# Altium schematic sheet Voltage_Sense.SchDoc: Solar Sense Slave
size Tabloid; SheetNumber: 3; SheetTotal: 4; Website: www.uwmidsun.com
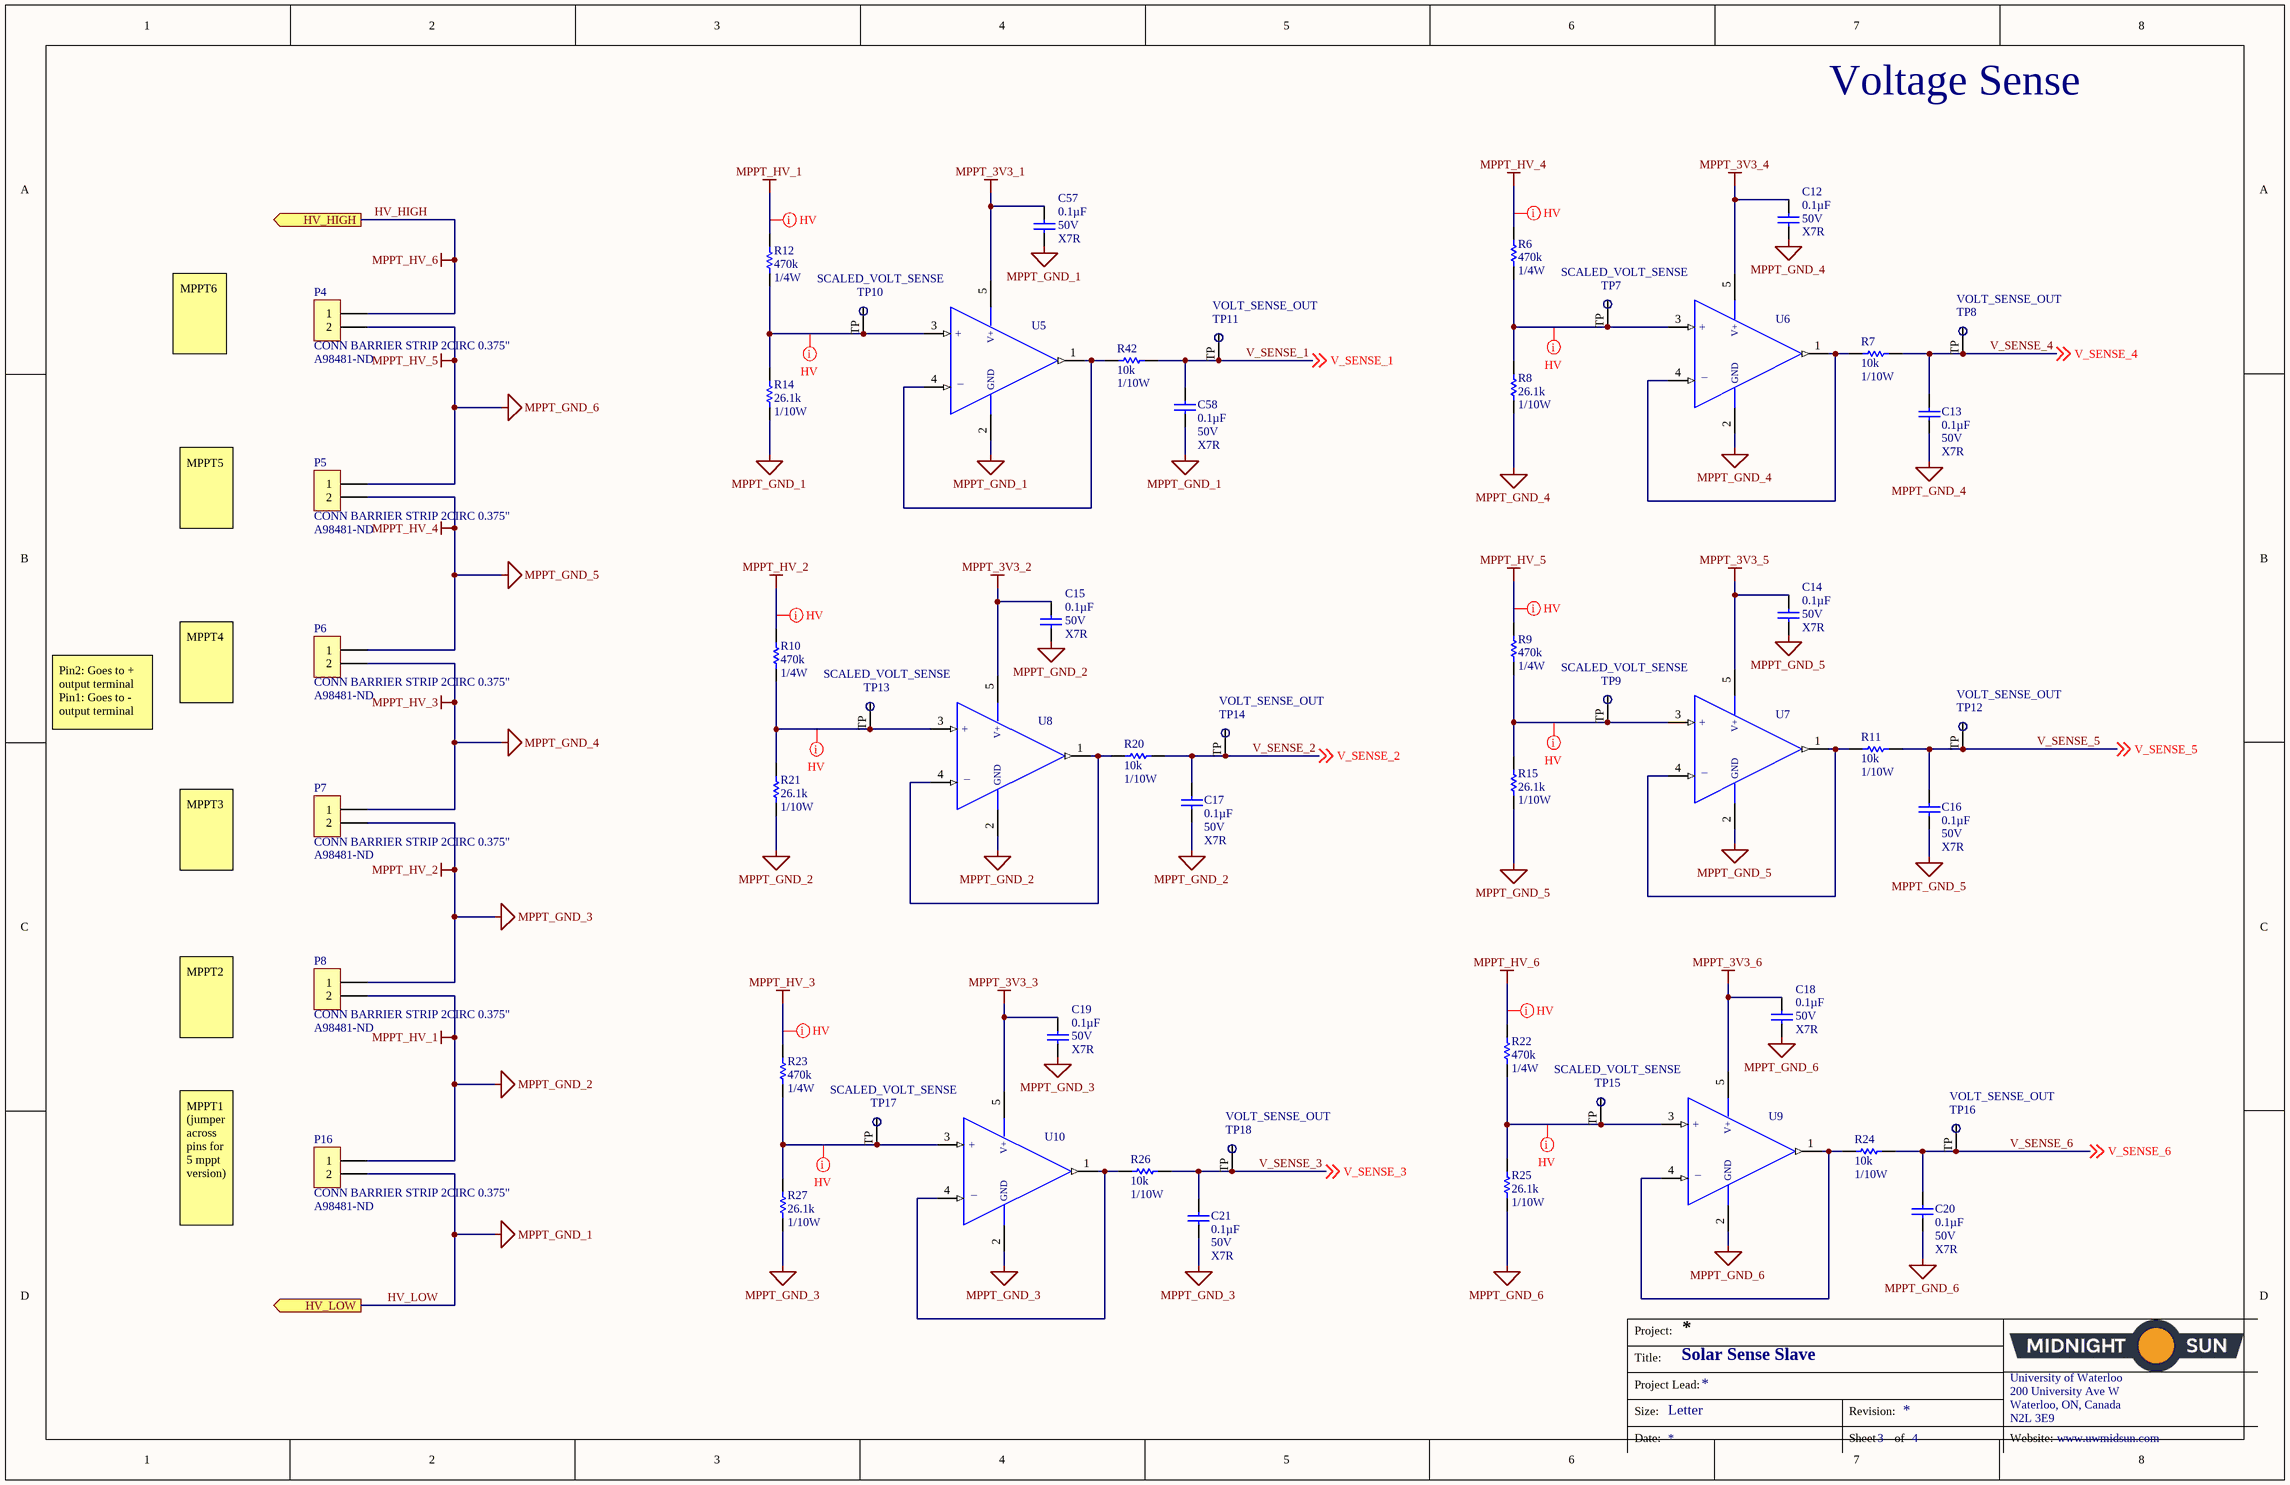
[diagram p0: Voltage_Sense.SchDoc]

## Parts
C12  Capacitance: 0.1µF  Voltage: 50V  Temperature Coefficient: X7R  [CAP, 0603]  (hidden comment: CAP CER 0.1UF 50V 10% X7R 0603)
C13  Capacitance: 0.1µF  Voltage: 50V  Temperature Coefficient: X7R  [CAP, 0603]  (hidden comment: CAP CER 0.1UF 50V 10% X7R 0603)
C14  Capacitance: 0.1µF  Voltage: 50V  Temperature Coefficient: X7R  [CAP, 0603]  (hidden comment: CAP CER 0.1UF 50V 10% X7R 0603)
C15  Capacitance: 0.1µF  Voltage: 50V  Temperature Coefficient: X7R  [CAP, 0603]  (hidden comment: CAP CER 0.1UF 50V 10% X7R 0603)
C16  Capacitance: 0.1µF  Voltage: 50V  Temperature Coefficient: X7R  [CAP, 0603]  (hidden comment: CAP CER 0.1UF 50V 10% X7R 0603)
C17  Capacitance: 0.1µF  Voltage: 50V  Temperature Coefficient: X7R  [CAP, 0603]  (hidden comment: CAP CER 0.1UF 50V 10% X7R 0603)
C18  Capacitance: 0.1µF  Voltage: 50V  Temperature Coefficient: X7R  [CAP, 0603]  (hidden comment: CAP CER 0.1UF 50V 10% X7R 0603)
C19  Capacitance: 0.1µF  Voltage: 50V  Temperature Coefficient: X7R  [CAP, 0603]  (hidden comment: CAP CER 0.1UF 50V 10% X7R 0603)
C20  Capacitance: 0.1µF  Voltage: 50V  Temperature Coefficient: X7R  [CAP, 0603]  (hidden comment: CAP CER 0.1UF 50V 10% X7R 0603)
C21  Capacitance: 0.1µF  Voltage: 50V  Temperature Coefficient: X7R  [CAP, 0603]  (hidden comment: CAP CER 0.1UF 50V 10% X7R 0603)
C57  Capacitance: 0.1µF  Voltage: 50V  Temperature Coefficient: X7R  [CAP, 0603]  (hidden comment: CAP CER 0.1UF 50V 10% X7R 0603)
C58  Capacitance: 0.1µF  Voltage: 50V  Temperature Coefficient: X7R  [CAP, 0603]  (hidden comment: CAP CER 0.1UF 50V 10% X7R 0603)
P4  CONN BARRIER STRIP 2CIRC 0.375"  Supplier Part Number 1: A98481-ND  [TE_3-1437652-9]
P5  CONN BARRIER STRIP 2CIRC 0.375"  Supplier Part Number 1: A98481-ND  [TE_3-1437652-9]
P6  CONN BARRIER STRIP 2CIRC 0.375"  Supplier Part Number 1: A98481-ND  [TE_3-1437652-9]
P7  CONN BARRIER STRIP 2CIRC 0.375"  Supplier Part Number 1: A98481-ND  [TE_3-1437652-9]
P8  CONN BARRIER STRIP 2CIRC 0.375"  Supplier Part Number 1: A98481-ND  [TE_3-1437652-9]
P16  CONN BARRIER STRIP 2CIRC 0.375"  Supplier Part Number 1: A98481-ND  [TE_3-1437652-9]
R6  Resistance: 470k  Power: 1/4W  [RES, 0603]  (hidden comment: RES 470K OHM 1% 1/4W 0603)
R7  Resistance: 10k  Power: 1/10W  [RES, 0603]  (hidden comment: RES 10K OHM 1% 1/10W 0603)
R8  Resistance: 26.1k  Power: 1/10W  [RES, 0603]  (hidden comment: RES 26.1K OHM 1% 1/10W 0603)
R9  Resistance: 470k  Power: 1/4W  [RES, 0603]  (hidden comment: RES 470K OHM 1% 1/4W 0603)
R10  Resistance: 470k  Power: 1/4W  [RES, 0603]  (hidden comment: RES 470K OHM 1% 1/4W 0603)
R11  Resistance: 10k  Power: 1/10W  [RES, 0603]  (hidden comment: RES 10K OHM 1% 1/10W 0603)
R12  Resistance: 470k  Power: 1/4W  [RES, 0603]  (hidden comment: RES 470K OHM 1% 1/4W 0603)
R14  Resistance: 26.1k  Power: 1/10W  [RES, 0603]  (hidden comment: RES 26.1K OHM 1% 1/10W 0603)
R15  Resistance: 26.1k  Power: 1/10W  [RES, 0603]  (hidden comment: RES 26.1K OHM 1% 1/10W 0603)
R20  Resistance: 10k  Power: 1/10W  [RES, 0603]  (hidden comment: RES 10K OHM 1% 1/10W 0603)
R21  Resistance: 26.1k  Power: 1/10W  [RES, 0603]  (hidden comment: RES 26.1K OHM 1% 1/10W 0603)
R22  Resistance: 470k  Power: 1/4W  [RES, 0603]  (hidden comment: RES 470K OHM 1% 1/4W 0603)
R23  Resistance: 470k  Power: 1/4W  [RES, 0603]  (hidden comment: RES 470K OHM 1% 1/4W 0603)
R24  Resistance: 10k  Power: 1/10W  [RES, 0603]  (hidden comment: RES 10K OHM 1% 1/10W 0603)
R25  Resistance: 26.1k  Power: 1/10W  [RES, 0603]  (hidden comment: RES 26.1K OHM 1% 1/10W 0603)
R26  Resistance: 10k  Power: 1/10W  [RES, 0603]  (hidden comment: RES 10K OHM 1% 1/10W 0603)
R27  Resistance: 26.1k  Power: 1/10W  [RES, 0603]  (hidden comment: RES 26.1K OHM 1% 1/10W 0603)
R42  Resistance: 10k  Power: 1/10W  [RES, 0603]  (hidden comment: RES 10K OHM 1% 1/10W 0603)
TP7  SCALED_VOLT_SENSE  [Test Point]  (no BOM)
TP8  VOLT_SENSE_OUT  [Test Point]
TP9  SCALED_VOLT_SENSE  [Test Point]  (no BOM)
TP10  SCALED_VOLT_SENSE  [Test Point]  (no BOM)
TP11  VOLT_SENSE_OUT  [Test Point]
TP12  VOLT_SENSE_OUT  [Test Point]
TP13  SCALED_VOLT_SENSE  [Test Point]  (no BOM)
TP14  VOLT_SENSE_OUT  [Test Point]
TP15  SCALED_VOLT_SENSE  [Test Point]  (no BOM)
TP16  VOLT_SENSE_OUT  [Test Point]
TP17  SCALED_VOLT_SENSE  [Test Point]  (no BOM)
TP18  VOLT_SENSE_OUT  [Test Point]
U5  IC OP AMP GEN PURPOSE RR 10MHZ SOT-23-5  [IC OP AMP GP RR 10MHZ SOT-23-5]  (value not drawn)
U6  IC OP AMP GEN PURPOSE RR 10MHZ SOT-23-5  [IC OP AMP GP RR 10MHZ SOT-23-5]  (value not drawn)
U7  IC OP AMP GEN PURPOSE RR 10MHZ SOT-23-5  [IC OP AMP GP RR 10MHZ SOT-23-5]  (value not drawn)
U8  IC OP AMP GEN PURPOSE RR 10MHZ SOT-23-5  [IC OP AMP GP RR 10MHZ SOT-23-5]  (value not drawn)
U9  IC OP AMP GEN PURPOSE RR 10MHZ SOT-23-5  [IC OP AMP GP RR 10MHZ SOT-23-5]  (value not drawn)
U10  IC OP AMP GEN PURPOSE RR 10MHZ SOT-23-5  [IC OP AMP GP RR 10MHZ SOT-23-5]  (value not drawn)

## Ports
HV_HIGH (out), HV_LOW (out)

## Nets
HV_HIGH: P4.1 R22.1 ; port HV_HIGH  [also labelled MPPT_HV_6]
HV_LOW: C57.2 C58.2 P16.2 R14.2 U5.2(VSS) ; port HV_LOW  [also labelled MPPT_GND_1]
MPPT_3V3_1: C57.1 U5.5(VDD)
MPPT_3V3_2: C15.1 U8.5(VDD)
MPPT_3V3_3: C19.1 U10.5(VDD)
MPPT_3V3_4: C12.1 U6.5(VDD)
MPPT_3V3_5: C14.1 U7.5(VDD)
MPPT_3V3_6: C18.1 U9.5(VDD)
MPPT_GND_2: C15.2 C17.2 P8.2 P16.1 R12.1 R21.2 U8.2(VSS)  [also labelled MPPT_HV_1]
MPPT_GND_3: C19.2 C21.2 P7.2 P8.1 R10.1 R27.2 U10.2(VSS)  [also labelled MPPT_HV_2]
MPPT_GND_4: C12.2 C13.2 P6.2 P7.1 R8.2 R23.1 U6.2(VSS)  [also labelled MPPT_HV_3]
MPPT_GND_5: C14.2 C16.2 P5.2 P6.1 R6.1 R15.2 U7.2(VSS)  [also labelled MPPT_HV_4]
MPPT_GND_6: C18.2 C20.2 P4.2 P5.1 R9.1 R25.2 U9.2(VSS)  [also labelled MPPT_HV_5]
V_SENSE_1: C58.1 R42.2 TP11.TP ; off-sheet V_SENSE_1
V_SENSE_2: C17.1 R20.2 TP14.TP ; off-sheet V_SENSE_2
V_SENSE_3: C21.1 R26.2 TP18.TP ; off-sheet V_SENSE_3
V_SENSE_4: C13.1 R7.2 TP8.TP ; off-sheet V_SENSE_4
V_SENSE_5: C16.1 R11.2 TP12.TP ; off-sheet V_SENSE_5
V_SENSE_6: C20.1 R24.2 TP16.TP ; off-sheet V_SENSE_6
NetR6_2: R6.2 R8.1 TP7.TP U6.3(+IN)
NetR7_1: R7.1 U6.1(OUTPUT) U6.4(-IN)
NetR9_2: R9.2 R15.1 TP9.TP U7.3(+IN)
NetR10_2: R10.2 R21.1 TP13.TP U8.3(+IN)
NetR11_1: R11.1 U7.1(OUTPUT) U7.4(-IN)
NetR12_2: R12.2 R14.1 TP10.TP U5.3(+IN)
NetR20_1: R20.1 U8.1(OUTPUT) U8.4(-IN)
NetR22_2: R22.2 R25.1 TP15.TP U9.3(+IN)
NetR23_2: R23.2 R27.1 TP17.TP U10.3(+IN)
NetR24_1: R24.1 U9.1(OUTPUT) U9.4(-IN)
NetR26_1: R26.1 U10.1(OUTPUT) U10.4(-IN)
NetR42_1: R42.1 U5.1(OUTPUT) U5.4(-IN)

## Layout directives
net class HV: HV_HIGH, MPPT_GND_2, MPPT_GND_3, MPPT_GND_4, MPPT_GND_5, MPPT_GND_6, NetR6_2, NetR9_2, NetR10_2, NetR12_2, NetR22_2, NetR23_2

## Notes on the sheet
- Voltage Sense
- MPPT6
- MPPT5
- MPPT4
- Pin2: Goes to + output terminal
  Pin1: Goes to - output terminal
- MPPT3
- MPPT2
- MPPT1 (jumper across pins for 5 mppt version)
- Project:
- Title:
- Size:
- Project Lead:
- Letter
- Revision:
- University of Waterloo
- 200 University Ave W
- Waterloo, ON, Canada
- N2L 3E9
- Date:
- Sheet
- of
- Website:
- (in symbol IC OP AMP GEN PURPOSE RR 10MHZ SOT-23-5) V+; +; GND; _

## Library data of the parts
C12-C21 C57 C58 = CAP CER 0.1UF 50V 10% X7R 0603: 0.10µF ±10% 50V Ceramic Capacitor X7R 0603 (1608 Metric); Manufacturer 1: AVX Corporation; Manufacturer Part Number 1: 06035C104KAT2A; Supplier 1: Digi-Key; Supplier Part Number 1: 478-5052-1-ND; Packaging: Cut Tape (CT); Part Status: Active; Operating Temperature: -55°C ~ 125°C; Ratings: -; Mounting Type: Surface Mount, MLCC; Package / Case: 0603 (1608 Metric); Size / Dimension: 0.063" L x 0.032" W (1.60mm x 0.81mm); Height - Seated (Max): -; Thickness (Max): 0.035" (0.90mm); Lead Spacing: -; Lead Style: -; ComponentLink1URL: http://datasheets.avx.com/X7RDielectric.pdf; ComponentLink1Description: http://datasheets.avx.com/X7RDielectric.pdf; Tolerance: ±10%
P4-P8 P16 = CONN BARRIER STRIP 2CIRC 0.375": Barrier Terminal Blocks 2P TRI-BARRIER .375; Manufacturer: TE Connectivity; Manufacturer Part Number: 6PCV-02-006; Current Rating: 5A; Voltage Rating: 300V; Number of Contacts: 2; Max Current Rating: 25A; Mounting Ears: No (Without); Number of Levels: 1; Wire Gauge (Max): 12AWG; Wire Gauge (Min): 22AWG; Pitch: 9.53mm; Supplier 1: Digi-Key; RoHS: Yes; Category: Terminal Blocks; Stock 1: 8088; Pricing 1: 1=1.63000, 10=1.14400, 25=1.06680, 50=0.96820, 100=0.96400, 250=0.81404, 500=0.77122, 1000=0.68552, 5000=0.55699 (USD); Mount: Through Hole; Color: Black; Terminal Material: Copper Alloy; Contact Plating: Tin; Contact Material: Copper Alloy; Housing Color: Black; Housing Material: Thermoplastic; Package Quantity: 270; Number of Rows: 1; Packaging: Bulk; Termination: Solder; Number of Circuits: 2; Orientation: Straight; Number of Positions: 2; Mounting Insert: No (Without); Voltage: 300V; Length: 0.811inch; Height: 0.625inch; Wire/Cable Gauge: 22AWG; Width: 0.7inch; Flammability Rating: UL94 V-0; REACH SVHC: Unknown; ELV: Compliant; ComponentLink1URL: https://datasheet.ciiva.com/7978/1650932-7978603.pdf?src-supplier=Element14; ComponentLink1Description: https://datasheet.ciiva.com/7978/1650932-7978603.pdf?src-supplier=Element14
R6 R9 R10 R12 R22 R23 = RES 470K OHM 1% 1/4W 0603: RES SMD 470K OHM 1% 1/4W 0603; Manufacturer 1: Panasonic Electronic Components; Manufacturer Part Number 1: ERJ-PA3F4703V; Temperature Coefficient: ±100ppm/°C; Supplier 1: Digi-Key; Supplier Part Number 1: P470KBYCT-ND; Packaging: Cut Tape (CT); Part Status: Active; Composition: Thick Film; Operating Temperature: -55°C ~ 155°C; Package / Case: 0603 (1608 Metric); Supplier Device Package: 0603; Size / Dimension: 0.063" L x 0.031" W (1.60mm x 0.80mm); Height - Seated (Max): 0.022" (0.55mm); Failure Rate: -; ComponentLink1URL: https://industrial.panasonic.com/cdbs/www-data/pdf/RDO0000/AOA0000C291.pdf; ComponentLink1Description: https://industrial.panasonic.com/cdbs/www-data/pdf/RDO0000/AOA0000C291.pdf; Tolerance: ±1%
R7 R11 R20 R24 R26 R42 = RES 10K OHM 1% 1/10W 0603: RES SMD 10K OHM 1% 1/10W 0603; Manufacturer 1: Yageo; Manufacturer Part Number 1: RC0603FR-0710KL; Temperature Coefficient: ±100ppm/°C; Supplier 1: Digi-Key; Supplier Part Number 1: 311-10.0KHRCT-ND; Packaging: Cut Tape (CT); Part Status: Active; Composition: Thick Film; Operating Temperature: -55°C ~ 155°C; Package / Case: 0603 (1608 Metric); Supplier Device Package: 0603; Size / Dimension: 0.063" L x 0.031" W (1.60mm x 0.80mm); Height - Seated (Max): 0.022" (0.55mm); Failure Rate: -; ComponentLink1URL: http://www.yageo.com/documents/recent/PYu-RC_Group_51_RoHS_L_7.pdf; ComponentLink1Description: http://www.yageo.com/documents/recent/PYu-RC_Group_51_RoHS_L_7.pdf; Tolerance: ±1%
R8 R14 R15 R21 R25 R27 = RES 26.1K OHM 1% 1/10W 0603: RES SMD 26.1K OHM 1% 1/10W 0603; Manufacturer 1: Yageo; Manufacturer Part Number 1: RC0603FR-0726K1L; Temperature Coefficient: ±100ppm/°C; Supplier 1: Digi-Key; Supplier Part Number 1: 311-26.1KHRCT-ND; Packaging: Cut Tape (CT); Part Status: Active; Composition: Thick Film; Operating Temperature: -55°C ~ 155°C; Package / Case: 0603 (1608 Metric); Supplier Device Package: 0603; Size / Dimension: 0.063" L x 0.031" W (1.60mm x 0.80mm); Height - Seated (Max): 0.022" (0.55mm); Failure Rate: -; ComponentLink1URL: http://www.yageo.com/documents/recent/PYu-RC_Group_51_RoHS_L_7.pdf; ComponentLink1Description: http://www.yageo.com/documents/recent/PYu-RC_Group_51_RoHS_L_7.pdf; Tolerance: ±1%
TP7-TP18 = Test Point
U5-U10 = IC OP AMP GEN PURPOSE RR 10MHZ SOT-23-5: General Purpose Amplifier 1 Circuit Rail-to-Rail SOT-23-5; Manufacturer 1: Texas Instruments; Manufacturer Part Number 1: TLV316QDBVRQ1; Description 1: IC OP AMP GP RR 10MHZ 5-SOT-23; Number of Circuits: 1; Slew Rate: 6 V/µs; Current - Supply: 400µA; Current - Output / Channel: 50mA; Voltage - Supply, Single/Dual (±): 1.8 V ~ 5.5 V, ±0.9 V ~ 2.75 V; Supplier 1: Digi-Key; Supplier Part Number 1: 296-45323-1-ND; RoHS: RoHS Compliant; Category: Integrated Circuits (ICs); Stock 1: 1747; Pricing 1: 1=1.33, 10=1.185, 100=0.9234, 500=0.76276, 1000=0.60218 (CAD); Packaging: Cut Tape (CT); Part Status: Active; Amplifier Type: General Purpose; Output Type: Rail-to-Rail; -3db Bandwidth: -; Operating Temperature: -40°C ~ 125°C; Mounting Type: Surface Mount; Package / Case: SC-74A, SOT-753; Supplier Device Package: SOT-23-5; ComponentLink1URL: http://www.ti.com/lit/ds/symlink/tlv316-q1.pdf; ComponentLink1Description: http://www.ti.com/lit/ds/symlink/tlv316-q1.pdf